# EAGLE design Arduino (EAGLE 5.10)
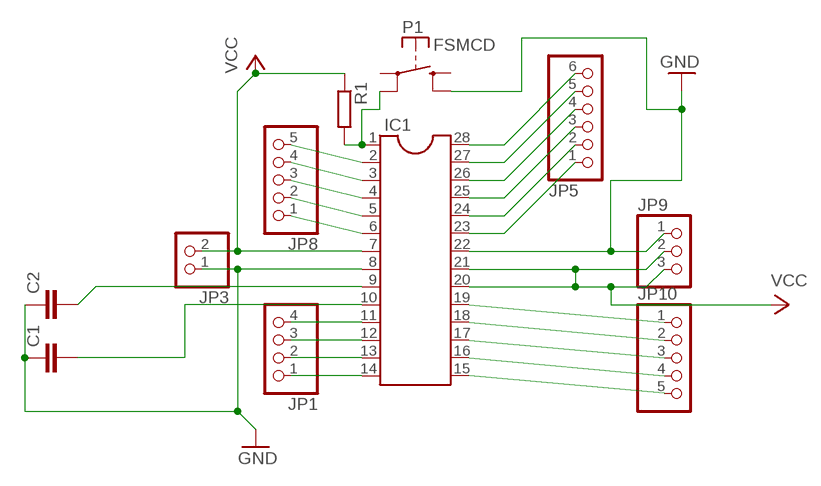
[diagram p0: schematic, sheet 1]

## Parts
C1  C-EU050-025X075  [C050-025X075]
C2  C-EU050-025X075  [C050-025X075]
IC1  DIL28-3  [DIL28-3]
JP1  PINHD-1X4  [1X04]
JP3  PINHD-1X2  [1X02]
JP5  PINHD-1X6  [1X06]
JP8  PINHD-1X5  [1X05]
JP9  PINHD-1X3  [1X03]
JP10  PINHD-1X5  [1X05]
P1  FSMCD  [FSMCD]
R1  R-EU_0207/10  [0207/10]

## Nets
GND: C1.1 C2.1 IC1.8 IC1.22 JP3.1 JP9.1 P1.P$4(S)
N$1: IC1.1 P1.P$2(P) R1.2
N$2: IC1.2 JP8.5
N$3: IC1.3 JP8.4
N$4: IC1.4 JP8.3
N$5: IC1.5 JP8.2
N$6: IC1.6 JP8.1
N$8: IC1.28 JP5.6
N$11: IC1.27 JP5.5
N$12: IC1.26 JP5.4
N$13: IC1.25 JP5.3
N$14: IC1.24 JP5.2
N$15: IC1.23 JP5.1
N$16: IC1.19 JP10.1
N$17: IC1.18 JP10.2
N$18: IC1.17 JP10.3
N$19: IC1.16 JP10.4
N$20: IC1.15 JP10.5
N$21: IC1.14 JP1.1
N$22: IC1.13 JP1.2
N$23: IC1.12 JP1.3
N$24: IC1.11 JP1.4
N$30: C2.2 IC1.9
N$31: C1.2 IC1.10
VCC: IC1.7 IC1.20 IC1.21 JP3.2 JP9.2 JP9.3 R1.1
Unconnected: P1.P$1(P) P1.P$3(S)

## Library data of the parts
C1 C2 = rcl:C-EU: CAPACITOR, European symbol
IC1 = ic-package:DIL28: Dual In Line
JP1 = pinhead:PINHD-1X4: PIN HEADER
JP3 = pinhead:PINHD-1X2: PIN HEADER
JP5 = pinhead:PINHD-1X6: PIN HEADER
JP8 JP10 = pinhead:PINHD-1X5: PIN HEADER
JP9 = pinhead:PINHD-1X3: PIN HEADER
P1 = switch-misc:FSMCD: TYCO SWITCH
R1 = rcl:R-EU_: RESISTOR, European symbol

## Board
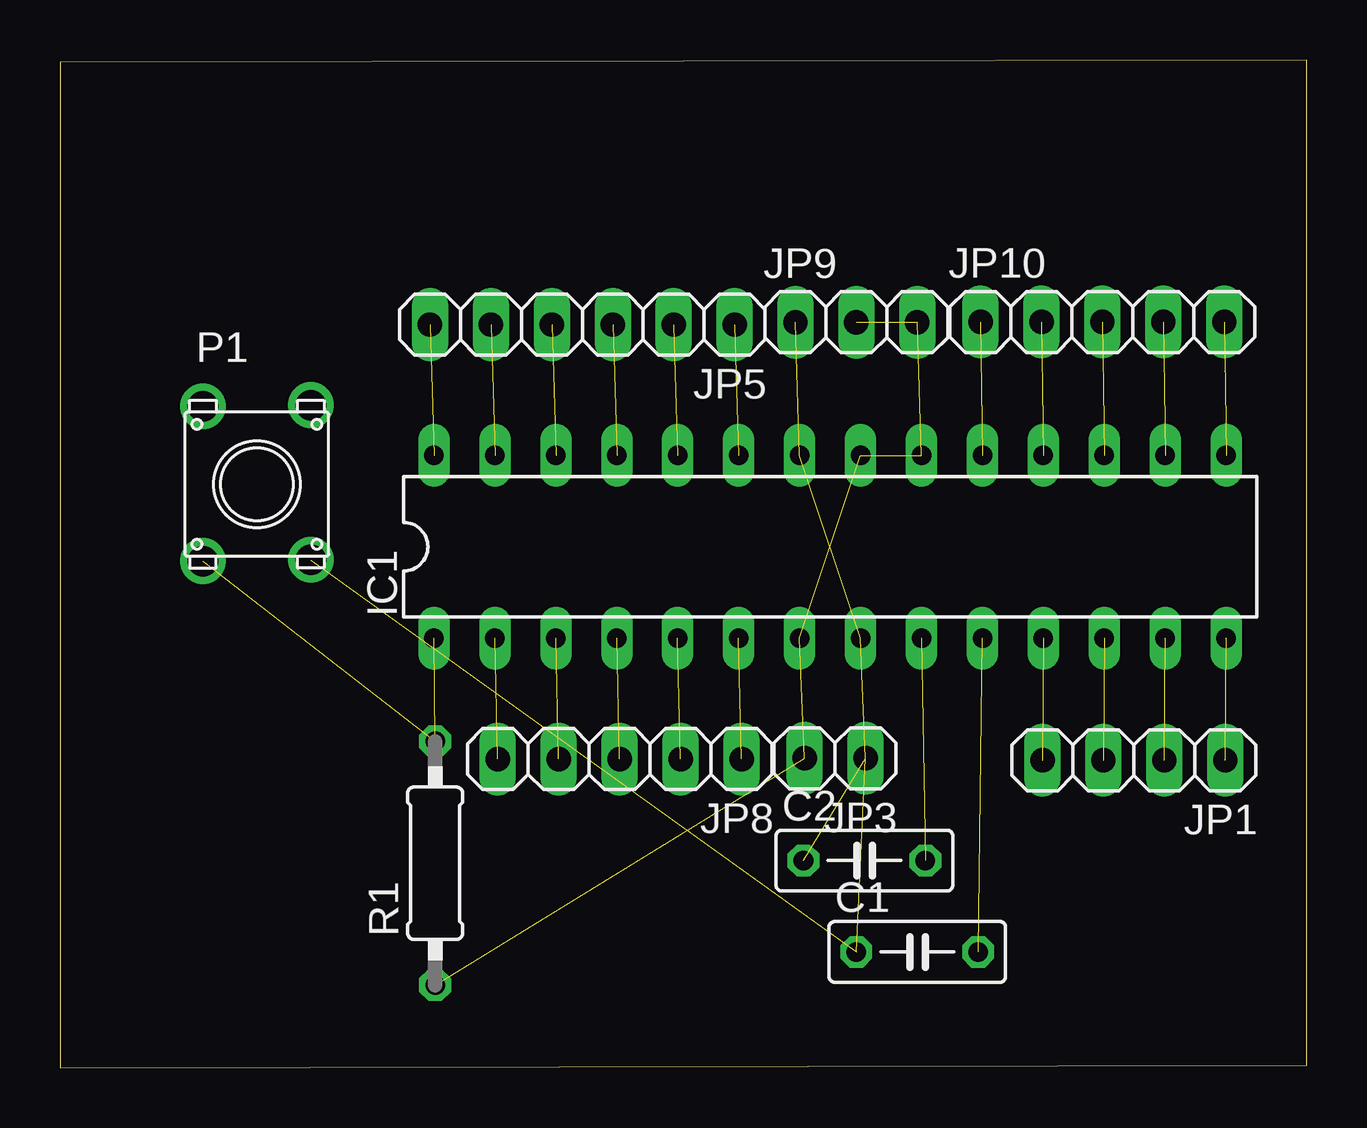
[diagram p1: board, top side]
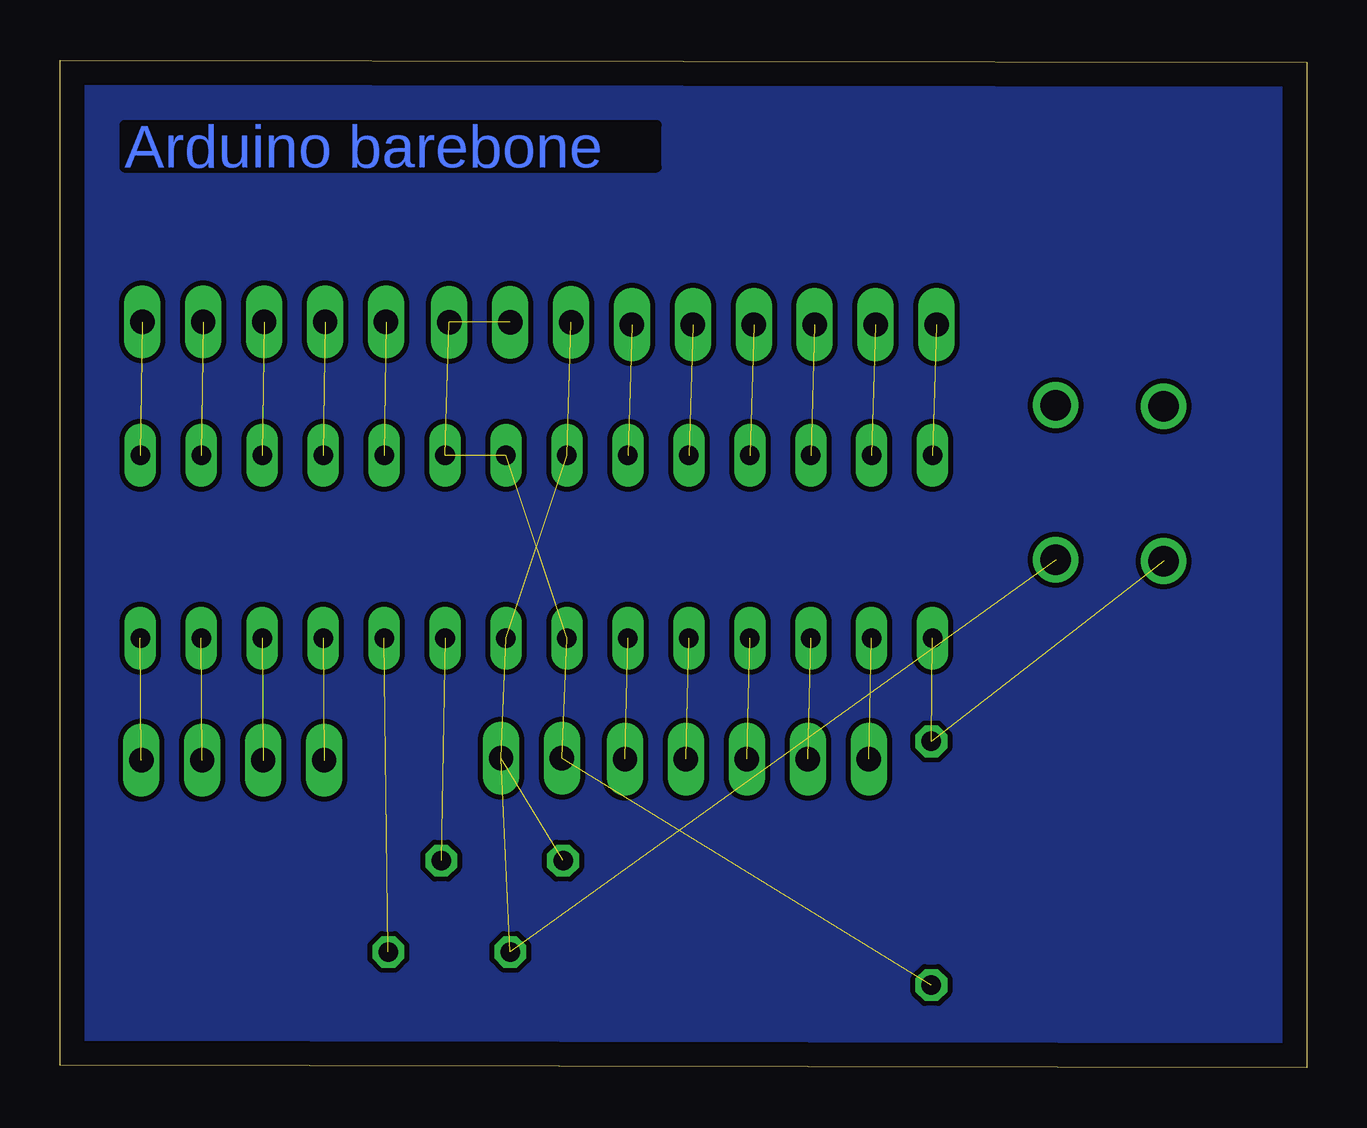
[diagram p2: board, bottom side, seen from below]

Size 51.96 x 42 mm. Coordinates in mm from the lower left corner, seen from the top.
Outline: 0,0 51.96,0.1 51.96,42 0,41.9 0,0
Copper layers (1*16): Top 0.035mm / dielectric 1.5mm / Bottom 0.035mm
Design rules "default": minimum track width 10mil, minimum drill 24mil, track to track 8mil, track to pad 8mil, pad to pad 8mil, via to via 8mil, smd to smd 8mil, copper to edge 40mil, drill to drill 8mil, minimum pad ring 10mil, minimum via ring 8mil, stop-mask expansion 4mil, vias tented up to drill 0mil, thermal gap 10mil

### Footprints (pad centres in the part's own frame; a part is rotated, then mirrored left to right if it is on the bottom)
C050-025X075 = drill 0.813 octagon: 1 -2.54,0; 2 2.54,0
DIL28-3 = drill 0.813 long: 1 -16.51,-3.81; 2 -13.97,-3.81; 3 -11.43,-3.81; 4 -8.89,-3.81; 5 -6.35,-3.81; 6 -3.81,-3.81; 7 -1.27,-3.81; 8 1.27,-3.81; 9 3.81,-3.81; 10 6.35,-3.81; 11 8.89,-3.81; 12 11.43,-3.81; 13 13.97,-3.81; 14 16.51,-3.81; 15 16.51,3.81; 16 13.97,3.81; 17 11.43,3.81; 18 8.89,3.81; 19 6.35,3.81; 20 3.81,3.81; 21 1.27,3.81; 22 -1.27,3.81; 23 -3.81,3.81; 24 -6.35,3.81; 25 -8.89,3.81; 26 -11.43,3.81; 27 -13.97,3.81; 28 -16.51,3.81
1X04 = drill 1.016 long: 1 -3.81,0; 2 -1.27,0; 3 1.27,0; 4 3.81,0
1X02 = drill 1.016 long: 1 -1.27,0; 2 1.27,0
1X06 = drill 1.016 long: 1 -6.35,0; 2 -3.81,0; 3 -1.27,0; 4 1.27,0; 5 3.81,0; 6 6.35,0
1X05 = drill 1.016 long: 1 -5.08,0; 2 -2.54,0; 3 0,0; 4 2.54,0; 5 5.08,0
1X03 = drill 1.016 long: 1 -2.54,0; 2 0,0; 3 2.54,0
FSMCD = drill 1.27 round: P$1 -2.25,3.25; P$2 -2.25,-3.2; P$3 2.25,3.3; P$4 2.25,-3.15
0207/10 = drill 0.813 octagon: 1 -5.08,0; 2 5.08,0

### Placement (x,y rotation side)
C1  35.73,4.82 0 top
C2  33.53,8.63 0 top
IC1  32.1,21.71 0 top
JP1  44.76,12.81 180 top
JP3  32.31,12.9 180 top
JP5  21.77,30.97 180 top
JP8  23.33,12.86 180 top
JP9  33.19,31.07 0 top
JP10  43.45,31.08 0 top
P1  8.21,24.32 0 top
R1  15.64,8.52 90 top

### Tracks (layer width: path | path; a pad name or v marks a point on that pad's centre or on a via)
GND  (6 unrouted)
N$1  (2 unrouted)
N$2  (1 unrouted)
N$3  (1 unrouted)
N$4  (1 unrouted)
N$5  (1 unrouted)
N$6  (1 unrouted)
N$8  (1 unrouted)
N$10
  pour Bottom: 5.38,42.08 52.03,41.9 52.03,0.18 0.08,-0.29 0.08,41.35 5.46,42
N$11  (1 unrouted)
N$12  (1 unrouted)
N$13  (1 unrouted)
N$14  (1 unrouted)
N$15  (1 unrouted)
N$16  (1 unrouted)
N$17  (1 unrouted)
N$18  (1 unrouted)
N$19  (1 unrouted)
N$20  (1 unrouted)
N$21  (1 unrouted)
N$22  (1 unrouted)
N$23  (1 unrouted)
N$24  (1 unrouted)
N$30  (1 unrouted)
N$31  (1 unrouted)
VCC  (6 unrouted)

### Text on the board
Bottom: Arduino barebone